# EAGLE board Motherboard - Rev2 (EAGLE 9.5.2), part 1 of 2
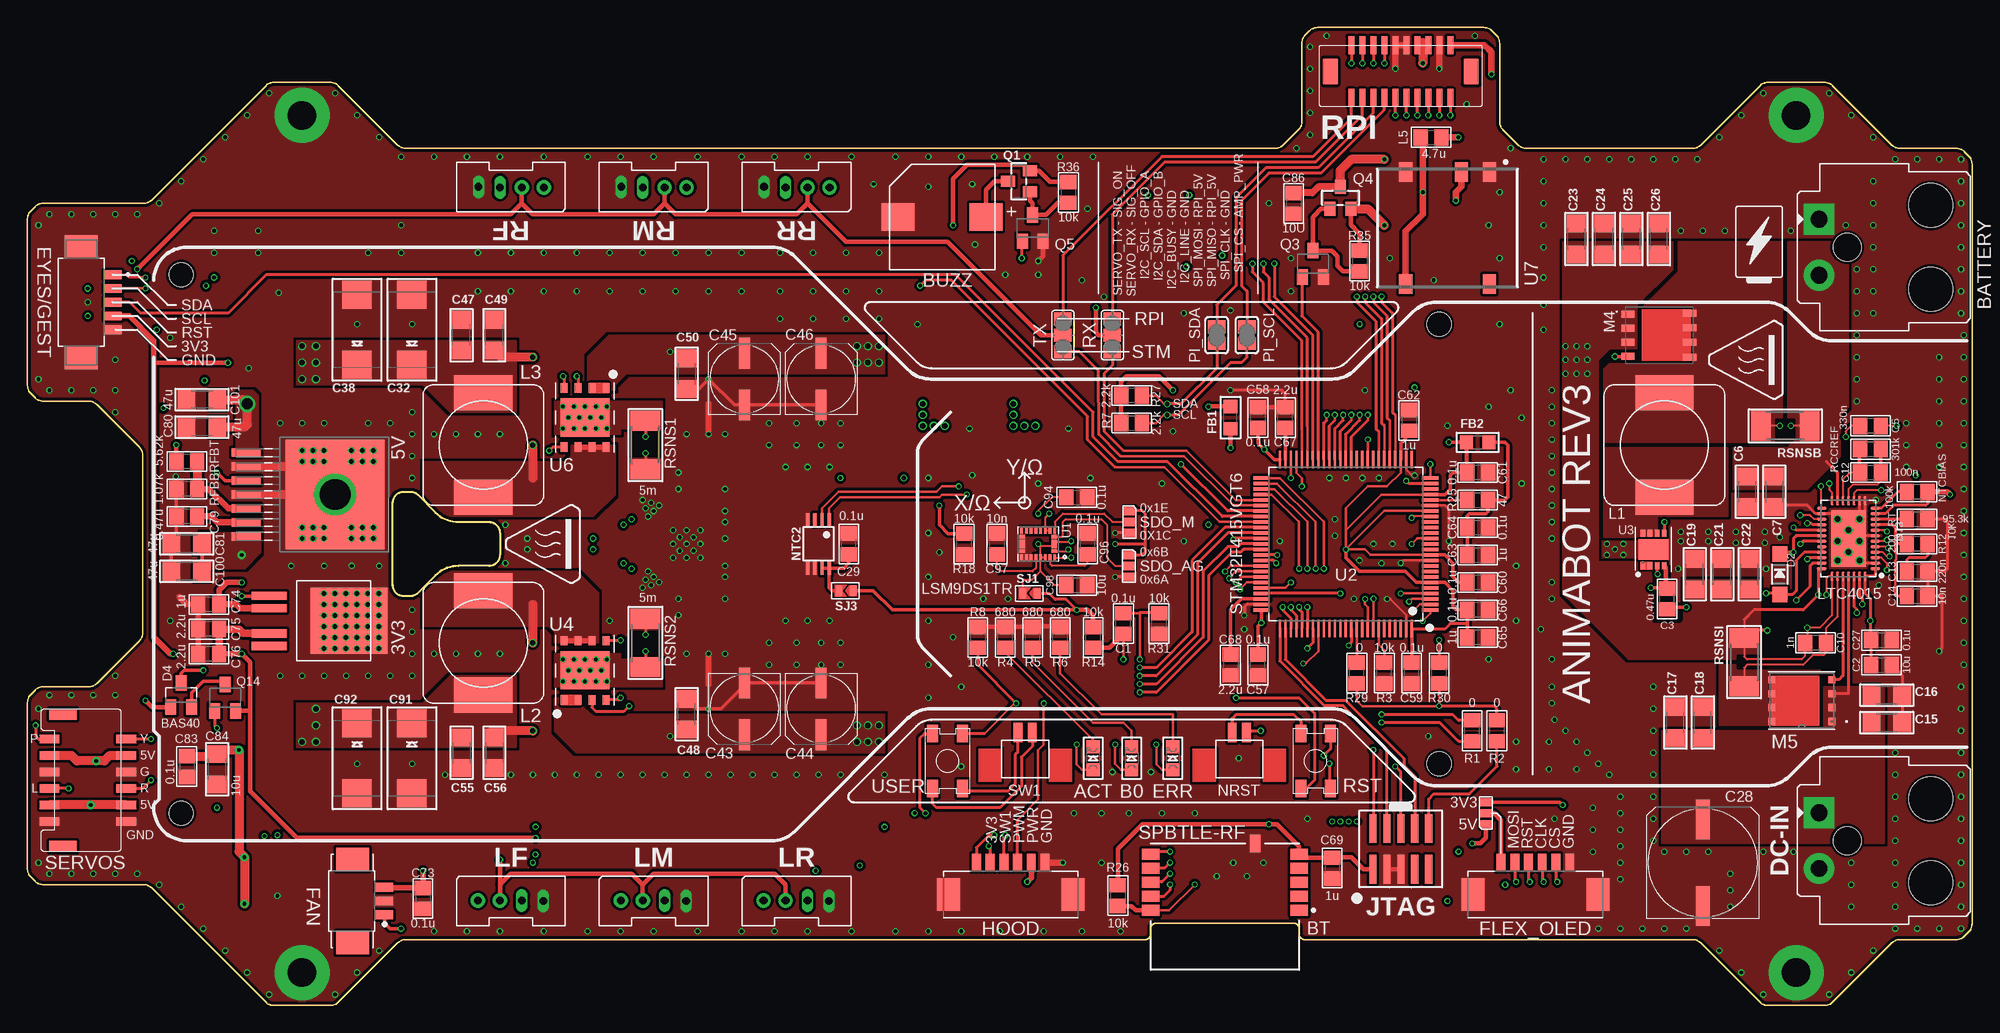
[diagram p2: board, top side]
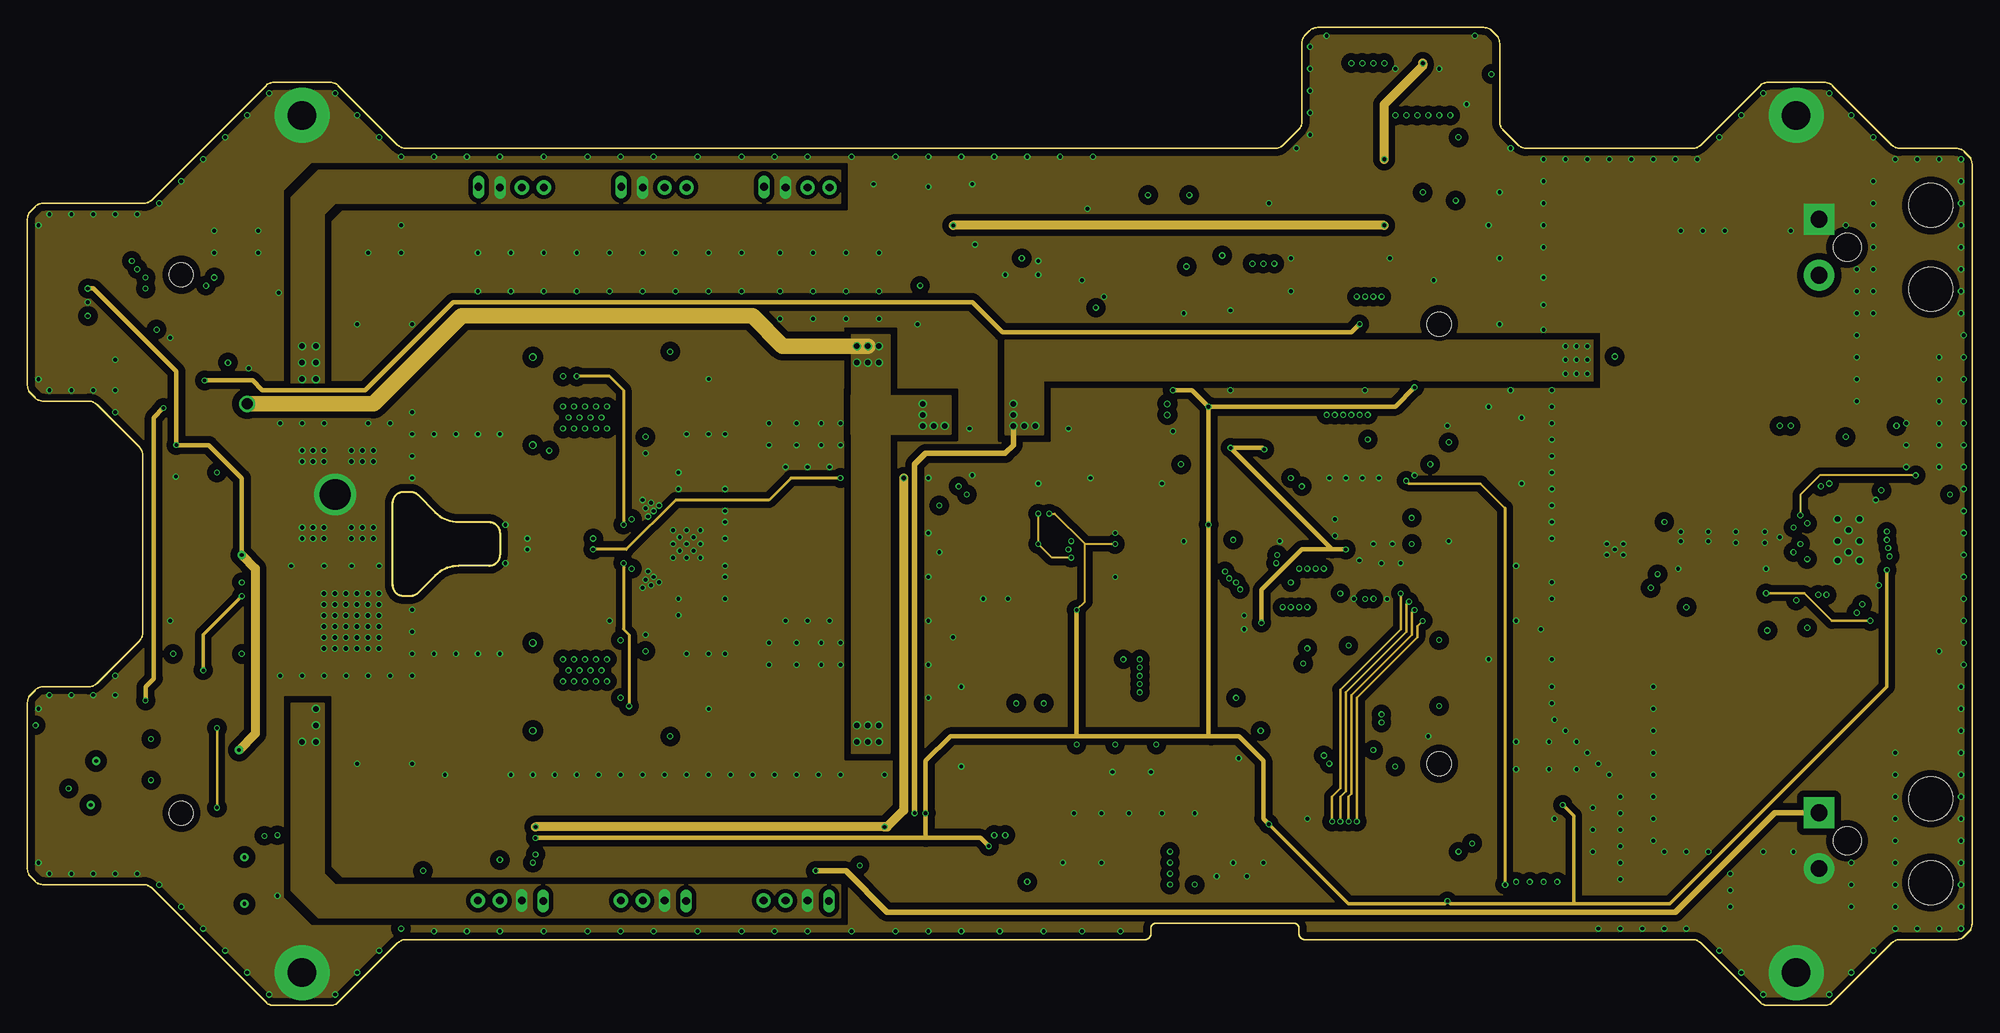
[diagram p3: board, inner layer Route2]
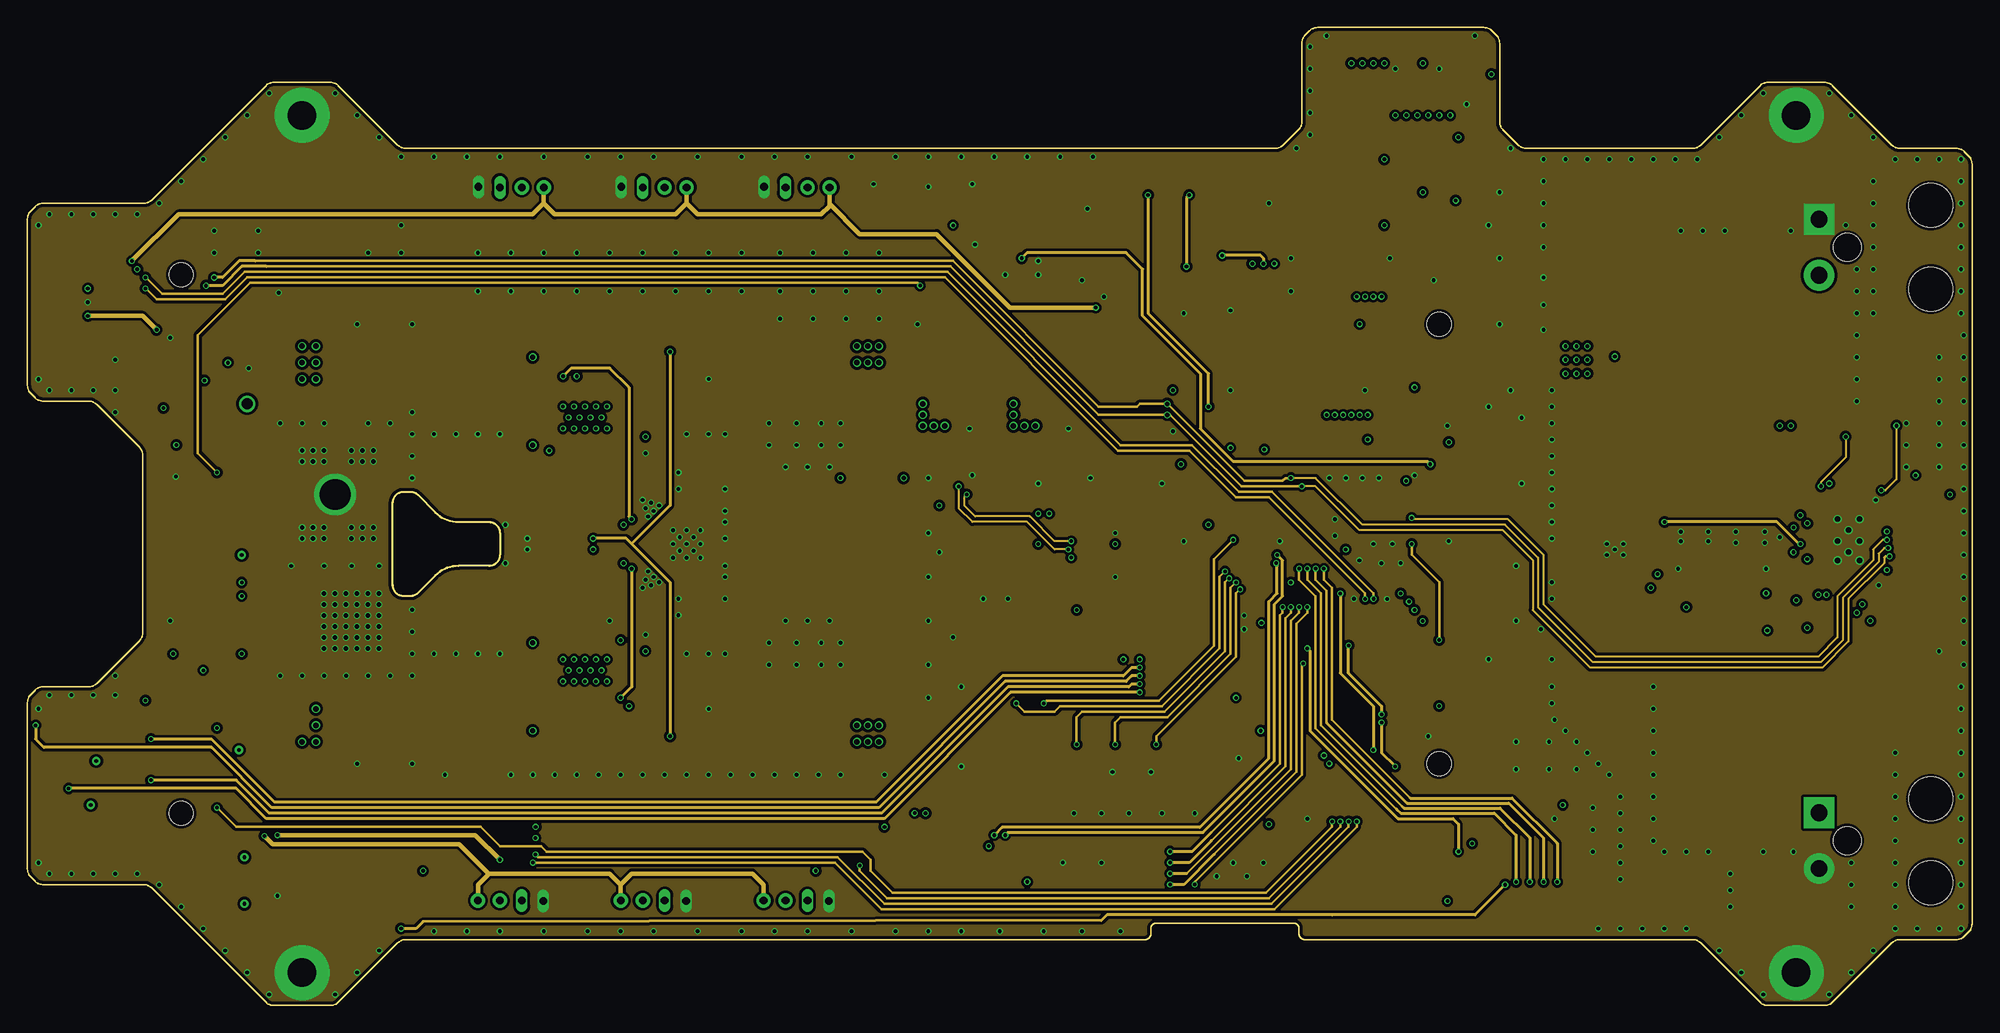
[diagram p4: board, inner layer Route15]
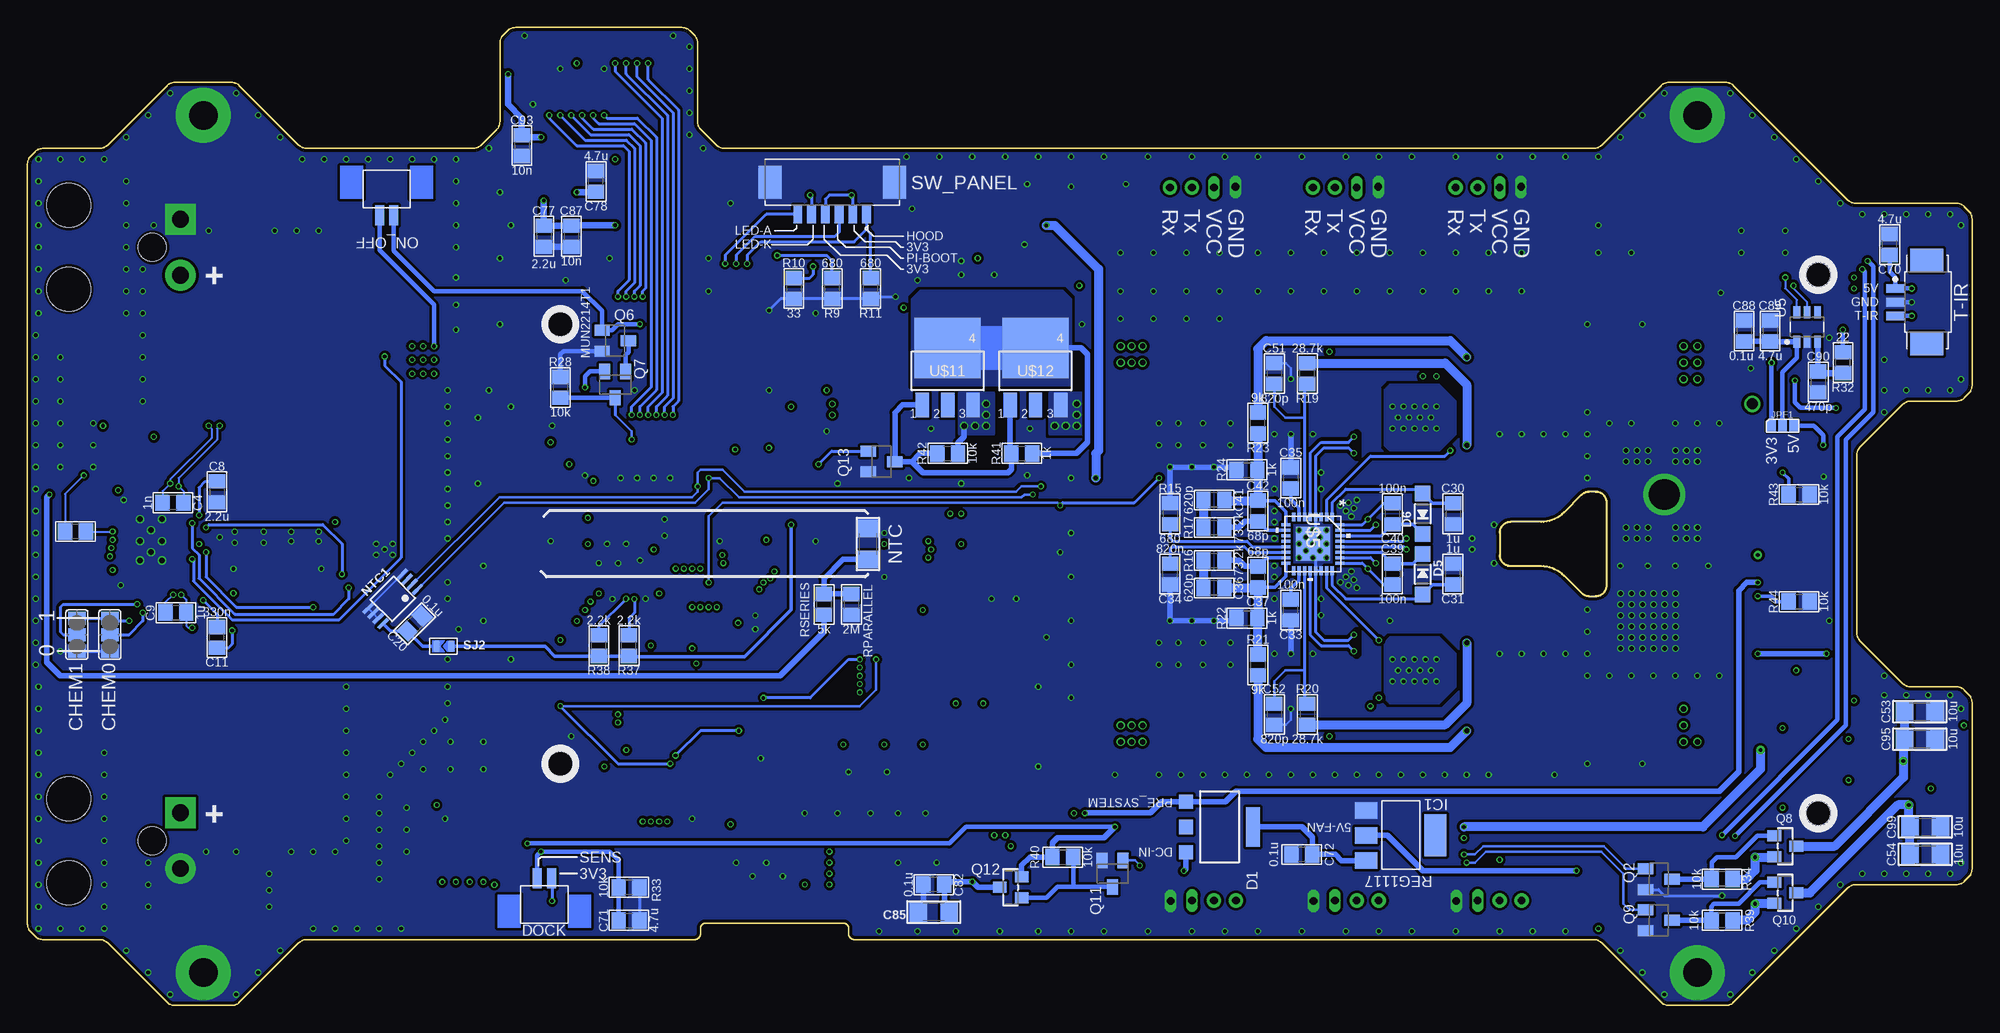
[diagram p5: board, bottom side, seen from below]

Size 177 x 89 mm. Coordinates in mm from the lower left corner, seen from the top.
Outline: 28.29,0.29 33.71,5.71 arc-45 34.41,6 101.75,6 arc90 102.25,6.5 102.25,7 arc-90 102.75,7.5 115.25,7.5 arc-90 115.75,7 115.75,6.5 arc90 116.25,6 151.59,6 arc-45 152.29,5.71 157.71,0.29 arc45 158.41,0 163.59,0 arc45 164.29,0.29 169.71,5.71 arc-45 170.41,6 175.59,6 arc45 176.29,6.29 176.71,6.71 arc45 177,7.41 177,76.59 arc45 176.71,77.29 176.29,77.71 arc45 175.59,78 170.41,78 arc-45 169.71,78.29 164.29,83.71 arc45 163.59,84 158.41,84 arc45 157.71,83.71 152.29,78.29 arc-45 151.59,78 136.41,78 arc-45 135.71,78.29 134.29,79.71 arc-45 134,80.41 134,87.59 arc45 133.71,88.29 133.29,88.71 arc45 132.59,89 117.41,89 arc45 116.71,88.71 116.29,88.29 arc45 116,87.59 116,80.41 arc-45 115.71,79.71 114.29,78.29 arc-45 113.59,78 34.41,78 arc-45 33.71,78.29 28.29,83.71 arc45 27.59,84 22.41,84 arc45 21.71,83.71 11.29,73.29 arc-45 10.59,73 1.41,73 arc45 0.71,72.71 0.29,72.29 arc45 0,71.59 0,56.41 arc45 0.29,55.71 0.71,55.29 arc45 1.41,55 5.59,55 arc-45 6.29,54.71 10.21,50.79 arc-45 10.5,50.09 10.5,33.91 arc-45 10.21,33.21 6.29,29.29 arc-45 5.59,29 1.41,29 arc45 0.71,28.71 0.29,28.29 arc45 0,27.59 0,12.41 arc45 0.29,11.71 0.71,11.29 arc45 1.41,11 10.59,11 arc-45 11.29,10.71 21.71,0.29 arc45 22.41,0 27.59,0 arc45 28.29,0.29
Outline: 35.54,46.46 37.12,44.88 arc45 39.24,44 42,44 arc-90 43,43 43,41 arc-90 42,40 39.24,40 arc45 37.12,39.12 35.54,37.54 arc-45 34.84,37.25 34.25,37.25 arc-90 33.25,38.25 33.25,45.75 arc-90 34.25,46.75 34.84,46.75 arc-45 35.54,46.46
Copper layers (1*2*15*16): Top 0.035mm / dielectric 0.2mm / Route2 0.0175mm / dielectric 0.3mm / Route15 0.0175mm / dielectric 0.2mm / Bottom 0.035mm
Design rules "SeeedStudio_4layer_DRU_no_angle_20140221": minimum track width 8mil, minimum drill 12mil, track to track 8mil, track to pad 8mil, pad to pad 8mil, via to via 8mil, smd to smd 0mil, copper to edge 10mil, drill to drill 8mil, minimum pad ring 6mil, minimum via ring 4mil, stop-mask expansion 4mil, vias tented up to drill 25mil, thermal gap 10mil
Holes 2.2 mm at 14,66.5 14,17.5 128.5,62 128.5,22
tRestrict: area 55,50.2 to 57.5,51.8; area 55,32.2 to 57.5,33.8
bRestrict: area 56,44.5 to 60.2,52; area 56,32 to 60.2,39.5

## Footprints (pad centres in the part's own frame; a part is rotated, then mirrored left to right if it is on the bottom)
NCP5500DT-33.50-RKG = smd 0.75 x 3.2: EN -2.28,-0.5; NC 2.28,-0.5; VIN -1.14,-0.5; VOUT 1.14,-0.5 | smd 6 x 7: GND 0,6.8
TZA07A = smd 0.787 x 2.667: 1 -3.81,-8.09; 2 -2.54,-8.09; 3 -1.27,-8.09; 4 0,-8.09; 5 1.27,-8.09; 6 2.54,-8.09; 7 3.81,-8.09 | smd 10 x 9: 8 0,0
CHIPLED_0805 = smd 1.2 x 1.2: A 0,-1.05; C 0,1.05
TE_794120-1 = drill 1.524 pad 2.794 square: 1 -2.54,-7.415 | drill 1.524 pad 2.794: 2 2.54,-7.415 | hole 3.99: -3.81,2.745; 3.81,2.745 | hole 2.54: 0,-4.875
XCVR_SPBTLE-RF = smd 1.6 x 1: 1 -6.75,0.33; 2 -6.75,-0.94; 3 -6.75,-2.21; 4 -6.75,-3.48; 5 -6.75,-4.75; 7 6.75,-4.75; 8 6.75,-3.48; 9 6.75,-2.21; 10 6.75,-0.94; 11 6.75,0.33 | smd 1 x 1.6: 6 -2.75,-5.75
CUI_CMI-9655S-SMT = smd 3 x 2.5: N -4,0; P 4,0
0805 = smd 1.3 x 1.5: 1 -0.95,0; 2 0.95,0
1206 = smd 1.6 x 1.8: 1 -1.4,0; 2 1.4,0
UD-10X10_NICHICON = smd 3.6 x 1.3: + 3.925,0; - -3.95,0
EIA7343-31/D-R = smd 2.55 x 2.7: + 3.175,0; - -3.175,0
UD-6,3X7,7_NICHICON = smd 2.8 x 1: + 2.35,0; - -2.35,0
SJ_2 = smd 1.168 x 1.6: 1 -1.5,0; 2 0,0; 3 1.5,0
SOT223 = smd 1.3 x 1.3: 1 -2.3,-3.05; 2 0,-3.05; 3 2.3,-3.05 | smd 3.6 x 1.3: 4 0,3.05
SOD-123 = smd 1.4 x 1.4: A 1.85,0; C -1.85,0
SOT23 = smd 1 x 1.4: 1 -0.95,-1.1; 2 0.95,-1.1; 3 0,1.1
MOLEX_53398 = smd 0.813 x 1.806: P$1 -0.591,2.341; P$2 0.709,2.341
MOLEX_0532610571 = smd 0.8 x 1.6: 1 -2.5,0.8; 2 -1.25,0.8; 3 0,0.8; 4 1.25,0.8; 5 2.5,0.8 | smd 2.1 x 3: S1 -5.05,-2.1; S2 5.05,-2.1
MOLEX_0532610371 = smd 0.8 x 1.6: 1 1.25,0; 2 0,0; 3 -1.25,0 | smd 2.1 x 3: 4 -3.8,-2.9; 5 3.8,-2.9
_0805 = smd 1.2 x 1.3: 1 -1.016,0; 2 1.016,0
MOLEX_0532610671 = smd 0.8 x 1.6: 1 -3.125,0; 2 -1.875,0; 3 -0.625,0; 4 0.625,0; 5 1.875,0; 6 3.125,0 | smd 2.1 x 3: S1 -5.675,-2.9; S2 5.675,-2.9
SOT223' = smd 1.499 x 2.007: 1 -2.261,-3.15; 2 0.025,-3.15; 3 2.311,-3.15 | smd 3.81 x 2.007: 4 0,3.15
SJ_3 = smd 0.75 x 1: P$1 -1,0; P$2 0,0; P$3 1,0
2X05_1.27MM_SMT = smd 0.65 x 2.6: 1 -2.54,-1.85; 2 -2.54,1.85; 3 -1.27,-1.85; 4 -1.27,1.85; 5 0,-1.85; 6 0,1.85; 7 1.27,-1.85; 8 1.27,1.85; 9 2.54,-1.85; 10 2.54,1.85
SRR1210-680MTR = smd 5.3 x 3.2: P$1 0,4.75; P$2 0,-4.75
JST_B4B-PH-K-S(LF)(SN) = drill 0.7 pad 1.3: 1 3,-0.55; 2 1,-0.55 | drill 0.7 long: 3 -1,-0.55; 4 -2.95,-0.5
QFN50P700X500X80-39N = smd 0.86 x 0.27: 1 -2.435,2.75; 2 -2.435,2.25; 3 -2.435,1.75; 4 -2.435,1.25; 5 -2.435,0.75; 6 -2.435,0.25; 7 -2.435,-0.25; 8 -2.435,-0.75; 9 -2.435,-1.25; 10 -2.435,-1.75; 11 -2.435,-2.25; 12 -2.435,-2.75; 20 2.435,-2.75; 21 2.435,-2.25; 22 2.435,-1.75; 23 2.435,-1.25; 24 2.435,-0.75; 25 2.435,-0.25; 26 2.435,0.25; 27 2.435,0.75; 28 2.435,1.25; 29 2.435,1.75; 30 2.435,2.25; 31 2.435,2.75 | smd 0.27 x 0.86: 13 -1.5,-3.435; 14 -1,-3.435; 15 -0.5,-3.435; 16 0,-3.435; 17 0.5,-3.435; 18 1,-3.435; 19 1.5,-3.435; 32 1.5,3.435; 33 1,3.435; 34 0.5,3.435; 35 0,3.435; 36 -0.5,3.435; 37 -1,3.435; 38 -1.5,3.435 | smd 3.15 x 5.15: 39 0,0
INFINEON_BSC030P03NS3_G_0 = smd 0.65 x 1.2: 1 -1.905,-2.825; 2 -0.635,-2.825; 3 0.635,-2.825; 4 1.905,-2.825; 5 2.007,2.794; 6 0.66,2.794; 7 -0.66,2.794; 8 -2.007,2.794
DQJ8 = smd 0.63 x 0.65: 1 -2.735,1.905; 2 -2.735,0.635; 3 -2.735,-0.635; 4 -2.735,-1.905; 5 2.735,-1.905; 6 2.735,-0.635; 7 2.735,0.635; 8 2.735,1.905
TSSOP8 = smd 1.2 x 0.305: 1 -2.2,0.975; 2 -2.2,0.325; 3 -2.2,-0.325; 4 -2.2,-0.975; 5 2.2,-0.975; 6 2.2,-0.325; 7 2.2,0.325; 8 2.2,0.975
SOLDERJUMPER_REFLOW = smd 1.168 x 1.6: 1 -0.762,0; 2 0.762,0
SOT23-WIDE = smd 1 x 1.27: 1 -0.95,-1; 2 0.95,-1; 3 0,1
SC59-BEC = smd 1 x 1.4: B -0.95,-1.2; C 0,1.2; E 0.95,-1.2
DF50-20DP-1V = smd 0.6 x 1.6: P$1 -4.5,-2.4; P$2 -4.5,2.4; P$3 -3.5,-2.4; P$4 -3.5,2.4; P$5 -2.5,-2.4; P$6 -2.5,2.4; P$7 -1.5,-2.4; P$8 -1.5,2.4; P$9 -0.5,-2.4; P$10 -0.5,2.4; P$11 0.5,-2.4; P$12 0.5,2.4; P$13 1.5,-2.4; P$14 1.5,2.4; P$15 2.5,-2.4; P$16 2.5,2.4; P$17 3.5,-2.4; P$18 3.5,2.4; P$19 4.5,-2.4; P$20 4.5,2.4 | smd 1.4 x 2.4: P$21 -6.4,0; P$22 6.4,0
2012 = smd 1.8 x 2.7: 1 -2.2,0; 2 2.2,0
MJTP1140ATR = smd 1.6 x 1: P$1 -2.5,1.35; P$2 2.5,1.35; P$3 2.5,-1.35; P$4 -2.5,-1.35
BM12B-ZPDSS-TF = smd 0.8 x 1.8: P$1 -3.75,-3.5; P$2 -2.25,-3.5; P$3 -0.75,-3.5; P$4 0.75,-3.5; P$5 2.25,-3.5; P$6 3.75,-3.5; P$7 3.75,3.5; P$8 2.25,3.5; P$9 0.75,3.5; P$10 -0.75,3.5; P$11 -2.25,3.5; P$12 -3.75,3.5 | smd 1 x 2.5: P$13 6,-2.25; P$14 -6,-2.25
SOLDERJUMPER_ARROW_NOPASTE = smd 0.6 x 1: 1 -0.916,0; 2 0.4,0
PQFN43P300X350X102-24N = smd 0.28 x 0.53: 1 -1.505,1.22; 6 -1.505,-1.22; 7 -1.075,-1.22; 8 -0.645,-1.22; 9 -0.215,-1.22; 10 0.215,-1.22; 11 0.645,-1.22; 12 1.075,-1.22; 13 1.505,-1.22; 18 1.505,1.22; 19 1.075,1.22; 20 0.645,1.22; 21 0.215,1.22; 22 -0.215,1.22; 23 -0.645,1.22; 24 -1.075,1.22 | smd 0.53 x 0.28: 2 -1.47,0.645; 3 -1.47,0.215; 4 -1.47,-0.215; 5 -1.47,-0.645; 14 1.47,-0.645; 15 1.47,-0.215; 16 1.47,0.215; 17 1.47,0.645
QFP50P1600X1600X160-100N = smd 1.56 x 0.28: 1 -7.68,6; 2 -7.68,5.5; 3 -7.68,5; 4 -7.68,4.5; 5 -7.68,4; 6 -7.68,3.5; 7 -7.68,3; 8 -7.68,2.5; 9 -7.68,2; 10 -7.68,1.5; 11 -7.68,1; 12 -7.68,0.5; 13 -7.68,0; 14 -7.68,-0.5; 15 -7.68,-1; 16 -7.68,-1.5; 17 -7.68,-2; 18 -7.68,-2.5; 19 -7.68,-3; 20 -7.68,-3.5; 21 -7.68,-4; 22 -7.68,-4.5; 23 -7.68,-5; 24 -7.68,-5.5; 25 -7.68,-6; 51 7.68,-6; 52 7.68,-5.5; 53 7.68,-5; 54 7.68,-4.5; 55 7.68,-4; 56 7.68,-3.5; 57 7.68,-3; 58 7.68,-2.5; 59 7.68,-2; 60 7.68,-1.5; 61 7.68,-1; 62 7.68,-0.5; 63 7.68,0; 64 7.68,0.5; 65 7.68,1; 66 7.68,1.5; 67 7.68,2; 68 7.68,2.5; 69 7.68,3; 70 7.68,3.5; 71 7.68,4; 72 7.68,4.5; 73 7.68,5; 74 7.68,5.5; 75 7.68,6 | smd 0.28 x 1.56: 26 -6,-7.68; 27 -5.5,-7.68; 28 -5,-7.68; 29 -4.5,-7.68; 30 -4,-7.68; 31 -3.5,-7.68; 32 -3,-7.68; 33 -2.5,-7.68; 34 -2,-7.68; 35 -1.5,-7.68; 36 -1,-7.68; 37 -0.5,-7.68; 38 0,-7.68; 39 0.5,-7.68; 40 1,-7.68; 41 1.5,-7.68; 42 2,-7.68; 43 2.5,-7.68; 44 3,-7.68; 45 3.5,-7.68; 46 4,-7.68; 47 4.5,-7.68; 48 5,-7.68; 49 5.5,-7.68; 50 6,-7.68; 76 6,7.68; 77 5.5,7.68; 78 5,7.68; 79 4.5,7.68; 80 4,7.68; 81 3.5,7.68; 82 3,7.68; 83 2.5,7.68; 84 2,7.68; 85 1.5,7.68; 86 1,7.68; 87 0.5,7.68; 88 0,7.68; 89 -0.5,7.68; 90 -1,7.68; 91 -1.5,7.68; 92 -2,7.68; 93 -2.5,7.68; 94 -3,7.68; 95 -3.5,7.68; 96 -4,7.68; 97 -4.5,7.68; 98 -5,7.68; 99 -5.5,7.68; 100 -6,7.68
DQZ8_1P8X2P7 = smd 0.65 x 0.44: 1 -1.482,0.975; 2 -1.482,0.325; 3 -1.482,-0.325; 4 -1.482,-0.975; 5 1.482,-0.975; 6 1.482,-0.325; 7 1.482,0.325; 8 1.482,0.975 | smd 1.85 x 2.75: 9 0,0
DQY8_3P2X4P3 = smd 0.85 x 0.65: 1 -2.692,1.905; 2 -2.692,0.635; 3 -2.692,-0.635; 4 -2.692,-1.905; 5 2.692,-1.905; 6 2.692,-0.635; 7 2.692,0.635; 8 2.692,1.905 | smd 3.48 x 4.46: 9 0,0
TEXAS_INSTRUMENTS_ADC101C021CIMK-NOPB_0 = smd 0.6 x 1.1: 1 -0.95,-1.35; 2 0,-1.35; 3 0.95,-1.35; 4 0.95,1.35; 5 0,1.35; 6 -0.95,1.35
SOIC254P1110X700-5N = smd 1.8 x 1.2: 1 -5.1,3.81; 3 -5.1,1.27; 7 -5.1,-3.81; 8 5.1,-3.81; 14 5.1,3.81
SQA32A = smd 0.813 x 0.305: 1 -2.451,1.75; 2 -2.451,1.25; 3 -2.451,0.75; 4 -2.451,0.25; 5 -2.451,-0.25; 6 -2.451,-0.75; 7 -2.451,-1.25; 8 -2.451,-1.75; 17 2.451,-1.75; 18 2.451,-1.25; 19 2.451,-0.75; 20 2.451,-0.25; 21 2.451,0.25; 22 2.451,0.75; 23 2.451,1.25; 24 2.451,1.75 | smd 0.305 x 0.813: 9 -1.75,-2.451; 10 -1.25,-2.451; 11 -0.75,-2.451; 12 -0.25,-2.451; 13 0.25,-2.451; 14 0.75,-2.451; 15 1.25,-2.451; 16 1.75,-2.451; 25 1.75,2.451; 26 1.25,2.451; 27 0.75,2.451; 28 0.25,2.451; 29 -0.25,2.451; 30 -0.75,2.451; 31 -1.25,2.451; 32 -1.75,2.451 | smd 3.099 x 3.099: 33 0,0
SOT223'' = smd 1.219 x 2.235: 1 -2.311,-3.099; 2 0,-3.099; 3 2.311,-3.099 | smd 6 x 5.5: 4 0,2.099

## Placement (x,y rotation side)
3V3  NCP5500DT-33.50-RKG  [NCP5500DT-33.50-RKG]  22.5,35 270 top
5V  LMZ23605TZE/NOPB  [TZA07A]  28,46.5 270 top
ACT  [CHIPLED_0805]  97,22.5 0 top
B0  [CHIPLED_0805]  100.5,22.5 0 top
BATTERY  794120-1  [TE_794120-1]  170.5,69 270 top
BT  SPBTLE-RF  [XCVR_SPBTLE-RF]  109,9 180 top
BUZZ  CMI-9655S-SMT  [CUI_CMI-9655S-SMT]  83.25,71.75 0 top
C1  0.1u  [0805]  99.75,34.75 90 top
C2  10u  [0805]  168.75,31 0 top
C3  0.47u  [0805]  149.25,37 90 top
C4  1n  [0805]  163.75,45.75 180 bottom
C5  330n  [0805]  167.75,52.75 180 top
C6  10u  [1206]  156.5,46.75 270 top
C7  10u  [1206]  159,46.75 270 top
C8  2.2u  [0805]  159.75,46.75 270 bottom
C9  1u  [0805]  163.5,35.75 0 bottom
C10  1n  [0805]  162.75,33 180 top
C11  330n  [0805]  159.75,33.5 90 bottom
C12  100n  [0805]  167.75,48.5 0 top
C13  220n  [0805]  172,39.5 0 top
C14  10n  [0805]  172,37.25 0 top
C15  10u  [1206]  169.25,25.75 0 top
C16  10u  [1206]  169.25,28.25 0 top
C17  10u  [1206]  150,25.75 90 top
C18  10u  [1206]  152.5,25.75 90 top
C19  10u  [1206]  151.75,39.25 90 top
C20  0.1u  [0805]  141.75,34.75 45 bottom
C21  10u  [1206]  154.25,39.25 90 top
C22  10u  [1206]  156.75,39.25 90 top
C23  10u  [1206]  141,69.75 90 top
C24  10u  [1206]  143.5,69.75 90 top
C25  10u  [1206]  146,69.75 90 top
C26  10u  [1206]  148.5,69.75 90 top
C27  0.1u  [0805]  168.75,33.25 0 top
C28  220u  [UD-10X10_NICHICON]  152.5,13 90 top
C29  0.1u  [0805]  74.75,42 90 top
C30  1u  [0805]  47.25,44.75 270 bottom
C31  1u  [0805]  47.25,39.25 90 bottom
C32  330u  [EIA7343-31/D-R]  35,61.5 270 top
C33  100n  [0805]  62,36 90 bottom
C34  820n  [0805]  73,39.25 90 bottom
C35  100n  [0805]  62,48 270 bottom
C36  620p  [0805]  69,38 180 bottom
C37  68p  [0805]  65,39 90 bottom
C38  330u  [EIA7343-31/D-R]  30,61.5 270 top
C39  100n  [0805]  52.75,39.25 270 bottom
C40  100n  [0805]  52.75,44.75 90 bottom
C41  620p  [0805]  69,46 180 bottom
C42  68p  [0805]  65,45 270 bottom
C43  33u  [UD-6,3X7,7_NICHICON]  65.25,27 270 top
C44  33u  [UD-6,3X7,7_NICHICON]  72.25,27 270 top
C45  33u  [UD-6,3X7,7_NICHICON]  65.25,57 90 top
C46  33u  [UD-6,3X7,7_NICHICON]  72.25,57 90 top
C47  10u  [1206]  39.5,61 90 top
C48  100n  [1206]  60,26.5 90 top
C49  10u  [1206]  42.5,61 90 top
C50  10u  [1206]  60,57.5 270 top
C51  820p  [0805]  63.5,57.5 270 bottom
C52  820p  [0805]  63.5,26.5 270 bottom
C53  10u  [1206]  4.75,26.75 0 bottom
C54  10u  [1206]  4.25,13.75 0 bottom
C55  10u  [1206]  39.5,23 270 top
C56  10u  [1206]  42.5,23 270 top
C57  0.1u  [0805]  112,31 90 top
C58  0.1u  [0805]  112,53.5 270 top
C59  0.1u  [0805]  126,30.25 90 top
C60  0.1u  [0805]  132,38.5 180 top
C61  0.1u  [0805]  132,48.5 180 top
C62  1u  [0805]  125.75,53.25 270 top
C63  1u  [0805]  132,41 0 top
C64  0.1u  [0805]  132,43.5 0 top
C65  1u  [0805]  132,33.5 180 top
C66  0.1u  [0805]  132,36 180 top
C67  2.2u  [0805]  114.5,53.5 90 top
C68  2.2u  [0805]  109.5,31 270 top
C69  1u  [0805]  118.75,12.5 270 top
C70  4.7u  [0805]  7.5,69.25 90 bottom
C71  4.7u  [0805]  122.25,7.75 0 bottom
C72  0.1u  [0805]  61,13.75 180 bottom
C73  0.1u  [0805]  36,9.75 270 top
C74  1u  [0805]  16.5,36.5 180 top
C75  2.2u  [0805]  16.5,34.25 180 top
C76  2.2u  [0805]  16.5,32 180 top
C77  2.2u  [0805]  130,70 270 bottom
C78  4.7u  [0805]  125.25,75 90 bottom
C79  0.47u  [0805]  14.5,44.5 180 top
C80  47u  [1206]  15.88,52.62 180 top
C81  47u  [1206]  14.5,42 180 top
C82  0.1u  [0805]  94.5,11 180 bottom
C83  0.1u  [0805]  14.5,21.75 270 top
C84  10u  [1206]  17.25,21.5 270 top
C85  10u  [1206]  94.5,8.5 180 bottom
C86  10U  [0805]  115.25,73 270 top
C87  10n  [0805]  127.5,70 270 bottom
C88  0.1u  [0805]  20.75,61.38 270 bottom
C89  4.7u  [0805]  18.38,61.38 270 bottom
C90  470p  [0805]  14,56.75 270 bottom
C91  330u  [EIA7343-31/D-R]  35,22.5 90 top
C92  330u  [EIA7343-31/D-R]  30,22.5 90 top
C93  10n  [0805]  132,78.25 270 bottom
C94  0.1u  [0805]  95.5,46.25 0 top
C95  10u  [1206]  4.75,24.25 0 bottom
C96  0.1u  [0805]  96.5,42 90 top
C97  10n  [0805]  88.25,42 90 top
C98  10u  [0805]  95.5,38.25 0 top
C99  10u  [1206]  4.25,16.25 0 bottom
C100  47u  [1206]  14.5,39.5 180 top
C101  47u  [1206]  15.88,55.12 180 top
CHEM0  [SJ_2]  169.5,33.75 270 bottom
CHEM1  [SJ_2]  172.5,33.75 270 bottom
D1  BAT120C  [SOT223]  68.5,16.25 270 bottom
D2  1N4148W  [SOD-123]  159.5,39.25 270 top
D4  BAS40  [SOT23]  14,28.25 0 top
D5  [SOD-123]  50,39.25 270 bottom
D6  [SOD-123]  50,44.75 90 bottom
DC-IN  794120-1  [TE_794120-1]  170.5,15 270 top
DOCK  MOLEX_53398  [MOLEX_53398]  130,9.25 0 bottom
ERR  [CHIPLED_0805]  104.25,22.5 0 top
EYES/GEST  [MOLEX_0532610571]  7,64 270 top
FAN  [MOLEX_0532610371]  32.5,9.5 270 top
FB1  [_0805]  109.5,53.5 90 top
FB2  [_0805]  132,51.25 0 top
FLEX_OLED  0532610671  [MOLEX_0532610671]  137.25,13 0 top
HOOD  0532610671  [MOLEX_0532610671]  89.5,13 0 top
IC1  REG1117  [SOT223']  52,15.5 270 bottom
JPF  [SJ_3]  132.75,17.5 90 top
JPF1  [SJ_3]  17.25,52.75 0 bottom
JTAG  [2X05_1.27MM_SMT]  125,14.25 0 top
L1  12µH  [SRR1210-680MTR]  149,51 180 top
L2  2.3u  [SRR1210-680MTR]  41.5,33 0 top
L3  2.3u  [SRR1210-680MTR]  41.5,51 0 top
L5  4.7u  [0805]  127.75,79 0 top
LF  B4B-PH-K-S(LF)(SN)  [JST_B4B-PH-K-S(LF)(SN)]  44,9 180 top
LM  B4B-PH-K-S(LF)(SN)  [JST_B4B-PH-K-S(LF)(SN)]  57,9 180 top
LR  B4B-PH-K-S(LF)(SN)  [JST_B4B-PH-K-S(LF)(SN)]  70,9 180 top
LTC4015  LTC4015EUHF  [QFN50P700X500X80-39N]  165.75,42.5 180 top
M4  INFINEON_BSC030P03NS3_GINFINEON_BSC030P03NS3_G_0_0  [INFINEON_BSC030P03NS3_G_0]  148.5,61 270 top
M5  [DQJ8]  161.5,27.75 180 top
NRST  MOLEX_53398  [MOLEX_53398]  110.25,22.5 0 top
NTC  100k  [1206]  100.5,42 270 bottom
NTC1  [TSSOP8]  143.75,37 225 bottom
NTC2  [TSSOP8]  72,42 270 top
NTCBIAS  100k  [0805]  172,46.75 180 top
ON_OFF  MOLEX_53398  [MOLEX_53398]  144.25,74.25 180 bottom
PI_SCL  [SOLDERJUMPER_REFLOW]  111,61 90 top
PI_SDA  [SOLDERJUMPER_REFLOW]  108.25,61 90 top
Q1  [SOT23-WIDE]  90.25,75 90 top
Q2  MUN2214T1  [SC59-BEC]  28.5,11.5 270 bottom
Q3  MUN2214T1  [SC59-BEC]  117,67.5 0 top
Q4  [SOT23-WIDE]  119.5,73.5 0 top
Q5  MUN2214T1  [SC59-BEC]  91.5,70.75 0 top
Q6  MUN2214T1  [SC59-BEC]  123.5,60.5 270 bottom
Q7  MUN2114T1  [SC59-BEC]  123.5,56.5 180 bottom
Q8  [SOT23-WIDE]  17,14.5 270 bottom
Q9  MUN2214T1  [SC59-BEC]  28.5,7.75 270 bottom
Q10  [SOT23-WIDE]  17,10.25 270 bottom
Q11  MUN2214T1  [SC59-BEC]  78.25,12 180 bottom
Q12  [SOT23-WIDE]  87.5,10.75 90 bottom
Q13  MUN2214T1  [SC59-BEC]  99.25,49.5 270 bottom
Q14  MUN2114T1  [SC59-BEC]  18,28 0 top
R1  0  [0805]  131.5,25 90 top
R2  0  [0805]  133.75,25 90 top
R3  10k  [0805]  123.5,30.25 90 top
R4  680  [0805]  89,33.5 90 top
R5  680  [0805]  91.5,33.5 90 top
R6  680  [0805]  94,33.5 90 top
R7  2.2k  [0805]  100.5,53 0 top
R8  10k  [0805]  86.5,33.5 270 top
R9  680  [0805]  103.75,65.25 90 bottom
R10  33  [0805]  107.25,65.25 270 bottom
R11  680  [0805]  100.25,65.25 90 bottom
R12  200  [0805]  172,42 180 top
R13  10k  [0805]  172.62,43.12 180 bottom
R14  10k  [0805]  97,33.5 90 top
R15  680  [0805]  73,44.75 270 bottom
R16  73.2k  [0805]  69,40.5 0 bottom
R17  73.2k  [0805]  69,43.5 0 bottom
R18  10k  [0805]  85.25,42 90 top
R19  28.7k  [0805]  60.5,57.5 90 bottom
R20  28.7k  [0805]  60.5,26.5 270 bottom
R21  9k  [0805]  65,31 270 bottom
R22  1k  [0805]  66,35.25 0 bottom
R23  9k  [0805]  65,53 90 bottom
R24  1k  [0805]  66,48.75 0 bottom
R25  47  [0805]  132,46 0 top
R26  10k  [0805]  99.25,10 270 top
R27  2.2k  [0805]  100.5,55.5 180 top
R28  10k  [0805]  128.5,56.25 270 bottom
R29  0  [0805]  121,30.25 90 top
R30  0  [0805]  128.5,30.25 90 top
R31  10k  [0805]  103,34.75 90 top
R32  22  [0805]  11.75,58.5 90 bottom
R33  10k  [0805]  122.25,10.75 180 bottom
R34  10k  [0805]  22.75,11.5 180 bottom
R35  10k  [0805]  121.25,67.75 270 top
R36  10k  [0805]  94.75,74 270 top
R37  2.2k  [0805]  122.25,32.75 90 bottom
R38  2.2k  [0805]  125,32.75 90 bottom
R39  10k  [0805]  22.75,7.75 180 bottom
R40  10k  [0805]  82.75,13.5 0 bottom
R41  1k  [0805]  86.5,50.25 0 bottom
R42  10k  [0805]  93.25,50.25 0 bottom
R43  10k  [0805]  15.75,46.5 0 bottom
R44  10k  [0805]  15.75,36.75 0 bottom
RCCREF  301k  [0805]  167.75,50.62 0 top
RF  B4B-PH-K-S(LF)(SN)  [JST_B4B-PH-K-S(LF)(SN)]  44,75 0 top
RFBB  1.07k  [0805]  14.5,47 180 top
RFBT  5.62k  [0805]  14.5,49.5 180 top
RM  B4B-PH-K-S(LF)(SN)  [JST_B4B-PH-K-S(LF)(SN)]  57,75 0 top
RPARALLEL  2M  [0805]  102,36.5 270 bottom
RPI  DF50-20DP-1V  [DF50-20DP-1V]  125,85 0 top
RR  B4B-PH-K-S(LF)(SN)  [JST_B4B-PH-K-S(LF)(SN)]  70,75 0 top
RSERIES  5k  [0805]  104.5,36.5 270 bottom
RSNS1  5m  [2012]  56.25,51 90 top
RSNS2  5m  [2012]  56.25,33 270 top
RSNSB  20m  [2012]  160,52.75 180 top
RSNSI  0.004  [2012]  156.25,31.25 270 top
RST  MJTP1140ATR  [MJTP1140ATR]  117.25,22.25 270 top
RT  95.3k  [0805]  172,44.25 0 top
RX  [SJ_2]  98.75,61 90 top
SDO_AG  [SJ_3]  100.25,40 270 top
SDO_M  [SJ_3]  100.3,44 270 top
SERVOS  BM12B-ZPDSS-TF  [BM12B-ZPDSS-TF]  5.5,20.5 270 top
SJ1  [SOLDERJUMPER_ARROW_NOPASTE]  91,37.5 180 top
SJ2  [SOLDERJUMPER_ARROW_NOPASTE]  139.35,32.7 180 bottom
SJ3  [SOLDERJUMPER_ARROW_NOPASTE]  74.25,37.75 180 top
SW1  MOLEX_53398  [MOLEX_53398]  90.75,22.5 0 top
SW_PANEL  [MOLEX_0532610671]  103.75,72 180 bottom
T-IR  [MOLEX_0532610371]  7,64 90 bottom
TX  [SJ_2]  94.25,61 90 top
U1  LSM9DS1TR  [PQFN43P300X350X102-24N]  92,42 180 top
U2  STM32F415VGT6  [QFP50P1600X1600X160-100N]  120,42 180 top
U3  CSD87330Q3D  [DQZ8_1P8X2P7]  148,41.5 90 top
U4  CSD87350Q5D  [DQY8_3P2X4P3]  50.75,30.5 90 top
U5  TEXAS_INSTRUMENTS_ADC101C021CIMK-NOPBTEXAS_INSTRUMENTS_ADC101C021CIMK-NOPB_0_0  [TEXAS_INSTRUMENTS_ADC101C021CIMK-NOPB_0]  15,61.75 0 bottom
U6  CSD87350Q5D  [DQY8_3P2X4P3]  50.75,53.5 270 top
U7  CRE1S0505MC  [SOIC254P1110X700-5N]  129.25,70.75 270 top
U$5  LM25119PSQ  [SQA32A]  60,42 270 bottom
U$11  NTF5P03T3  [SOT223'']  93.25,57.75 0 bottom
U$12  NTF5P03T3  [SOT223'']  85.25,57.75 0 bottom
USER  MJTP1140ATR  [MJTP1140ATR]  83.75,22.25 90 top